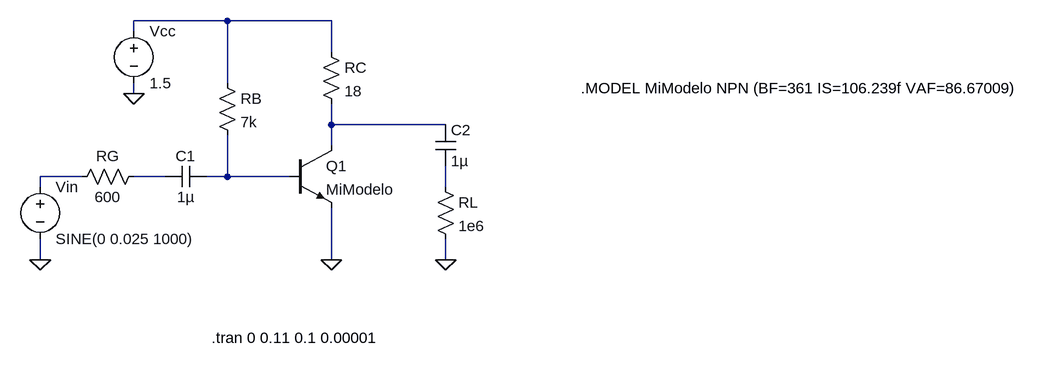
[diagram p0: schematic tp4siemens.asc]
tp4siemens.asc, the LTspice schematic file:
Version 4
SHEET 1 1060 680
WIRE -256 -112 -400 -112
WIRE -96 -112 -256 -112
WIRE -400 -96 -400 -112
WIRE -96 -64 -96 -112
WIRE -256 -16 -256 -112
WIRE -400 0 -400 -16
WIRE -96 48 -96 16
WIRE 80 48 -96 48
WIRE -96 80 -96 48
WIRE -480 128 -544 128
WIRE -352 128 -400 128
WIRE -256 128 -256 64
WIRE -256 128 -288 128
WIRE -160 128 -256 128
WIRE -544 144 -544 128
WIRE 80 144 80 112
WIRE -544 256 -544 224
WIRE -96 256 -96 176
WIRE 80 256 80 224
FLAG -96 256 0
FLAG -400 0 0
FLAG -544 256 0
FLAG 80 256 0
SYMBOL npn -160 80 R0
SYMATTR InstName Q1
SYMATTR Value MiModelo
SYMBOL voltage -400 -112 R0
WINDOW 123 0 0 Left 2
WINDOW 39 0 0 Left 2
SYMATTR InstName Vcc
SYMATTR Value 1.5
SYMBOL res -112 -80 R0
SYMATTR InstName RC
SYMATTR Value 18
SYMBOL res -272 -32 R0
SYMATTR InstName RB
SYMATTR Value 7k
SYMBOL voltage -544 128 R0
WINDOW 123 0 0 Left 2
WINDOW 39 0 0 Left 2
SYMATTR InstName Vin
SYMATTR Value SINE(0 0.025 1000)
SYMBOL res -384 112 R90
WINDOW 0 0 56 VBottom 2
WINDOW 3 32 56 VTop 2
SYMATTR InstName RG
SYMATTR Value 600
SYMBOL cap -288 112 R90
WINDOW 0 0 32 VBottom 2
WINDOW 3 32 32 VTop 2
SYMATTR InstName C1
SYMATTR Value 1µ
SYMBOL cap 64 48 R0
SYMATTR InstName C2
SYMATTR Value 1µ
SYMBOL res 64 128 R0
SYMATTR InstName RL
SYMATTR Value 1e6
TEXT -280 376 Left 2 !.tran 0 0.11 0.1 0.00001
TEXT 288 -8 Left 2 !.MODEL MiModelo NPN (BF=361 IS=106.239f VAF=86.67009)

The netlist it stands for:
* tp4siemens.asc
Q1 N002 N005 0 0 MiModelo
Vcc N001 0 1.5
RC N001 N002 18
RB N001 N005 7k
Vin N003 0 SINE(0 0.025 1000)
RG N004 N003 600
C1 N005 N004 1µ
C2 N002 N006 1µ
RL N006 0 1e6
.model NPN NPN
.model PNP PNP
.lib standard.bjt
.tran 0 0.11 0.1 0.00001
.MODEL MiModelo NPN (BF=361 IS=106.239f VAF=86.67009)
.backanno
.end